# EAGLE schematic cos POC (EAGLE 9.4.0)
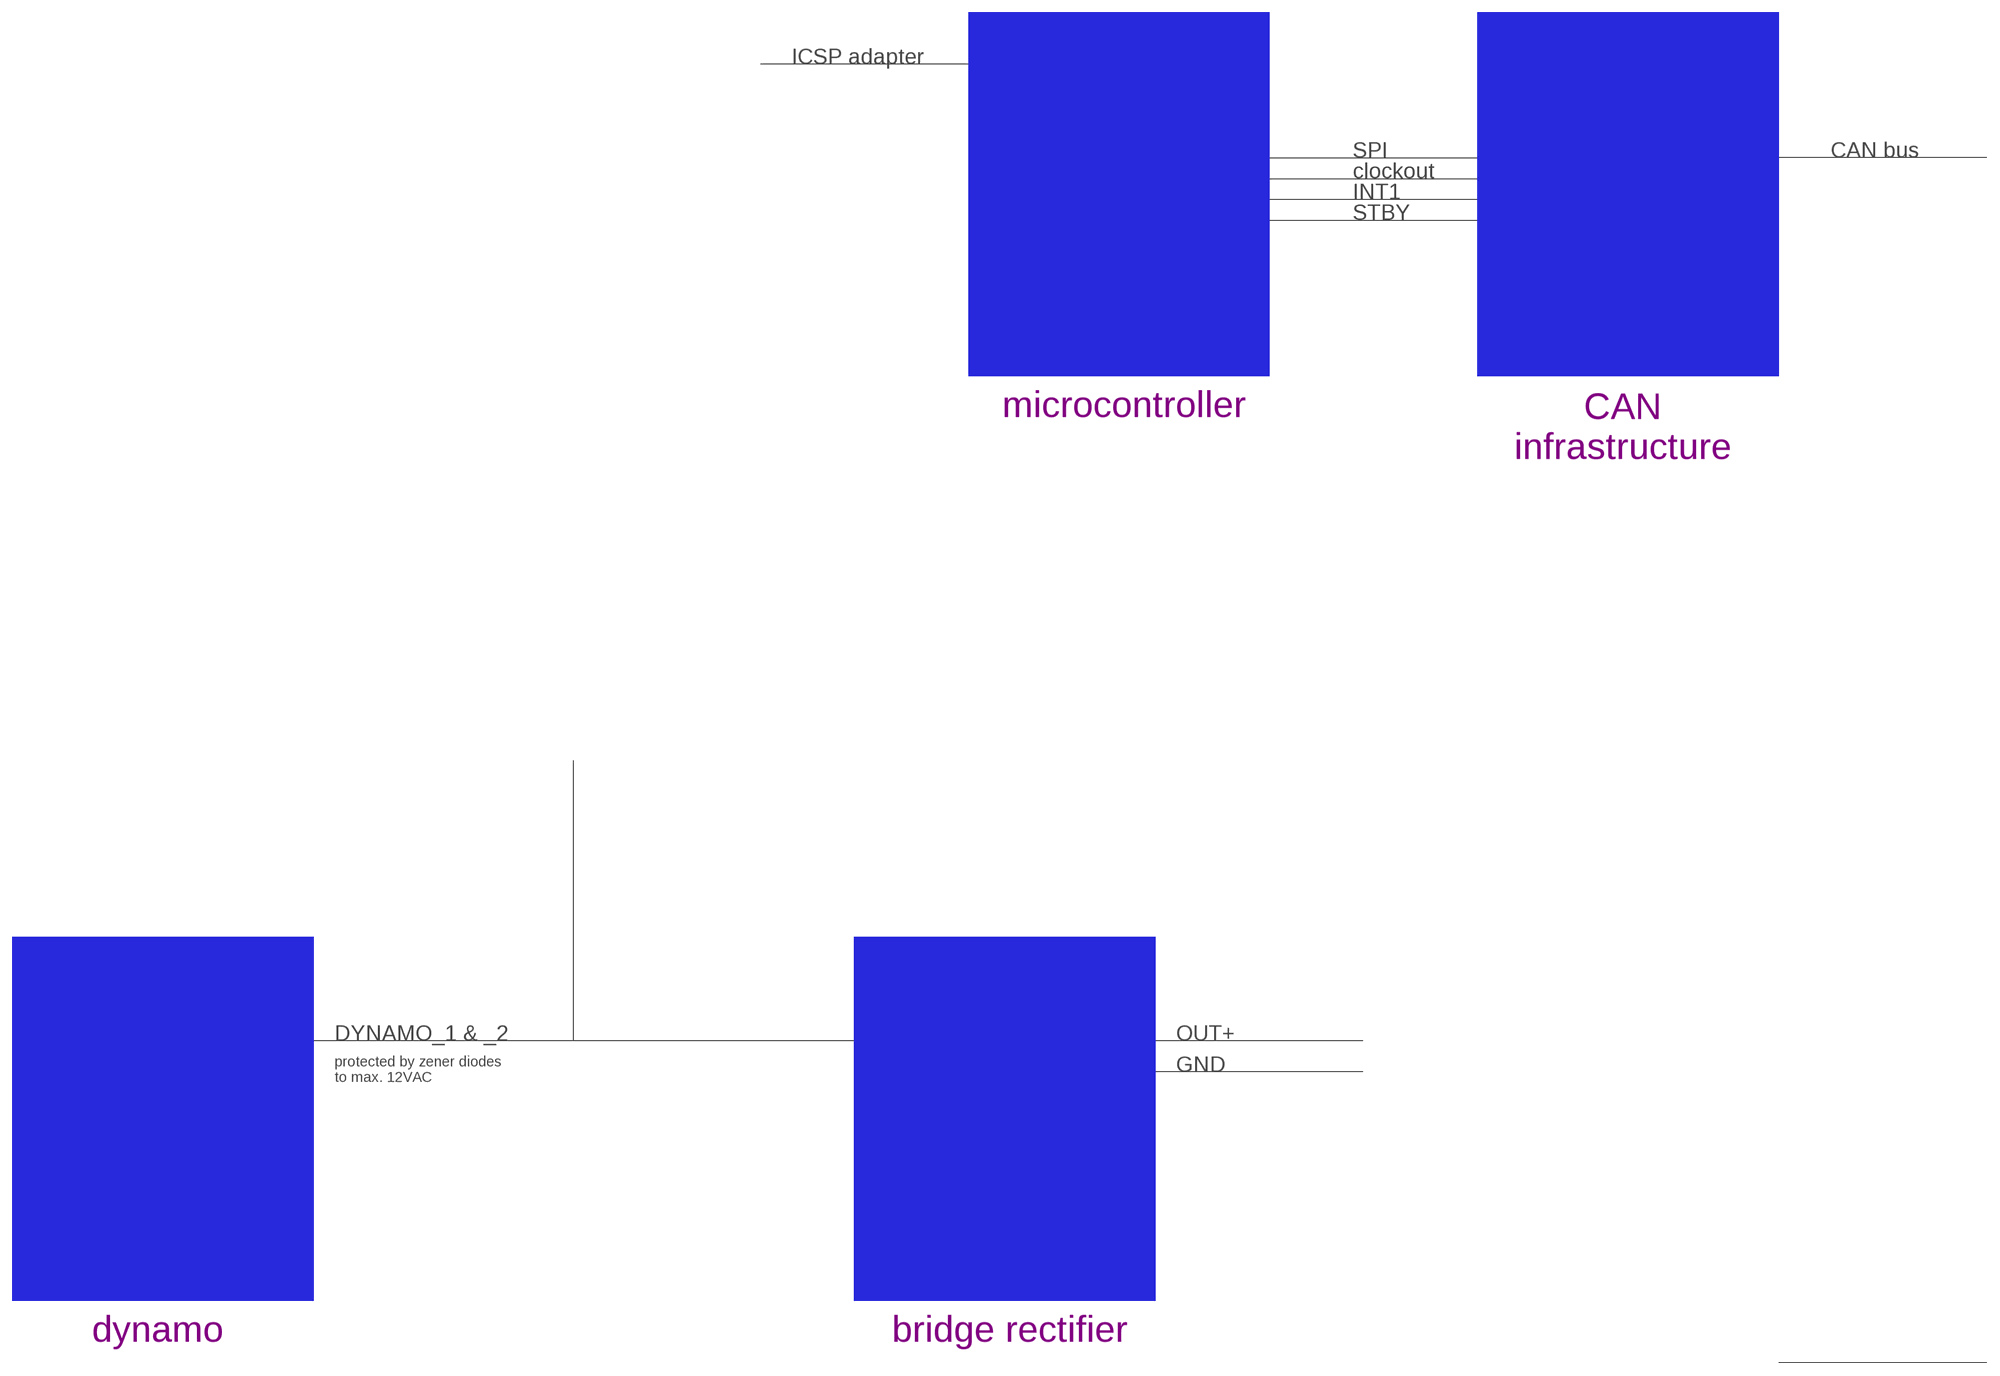
[diagram p0: schematic, sheet 1, part 1 of 3]
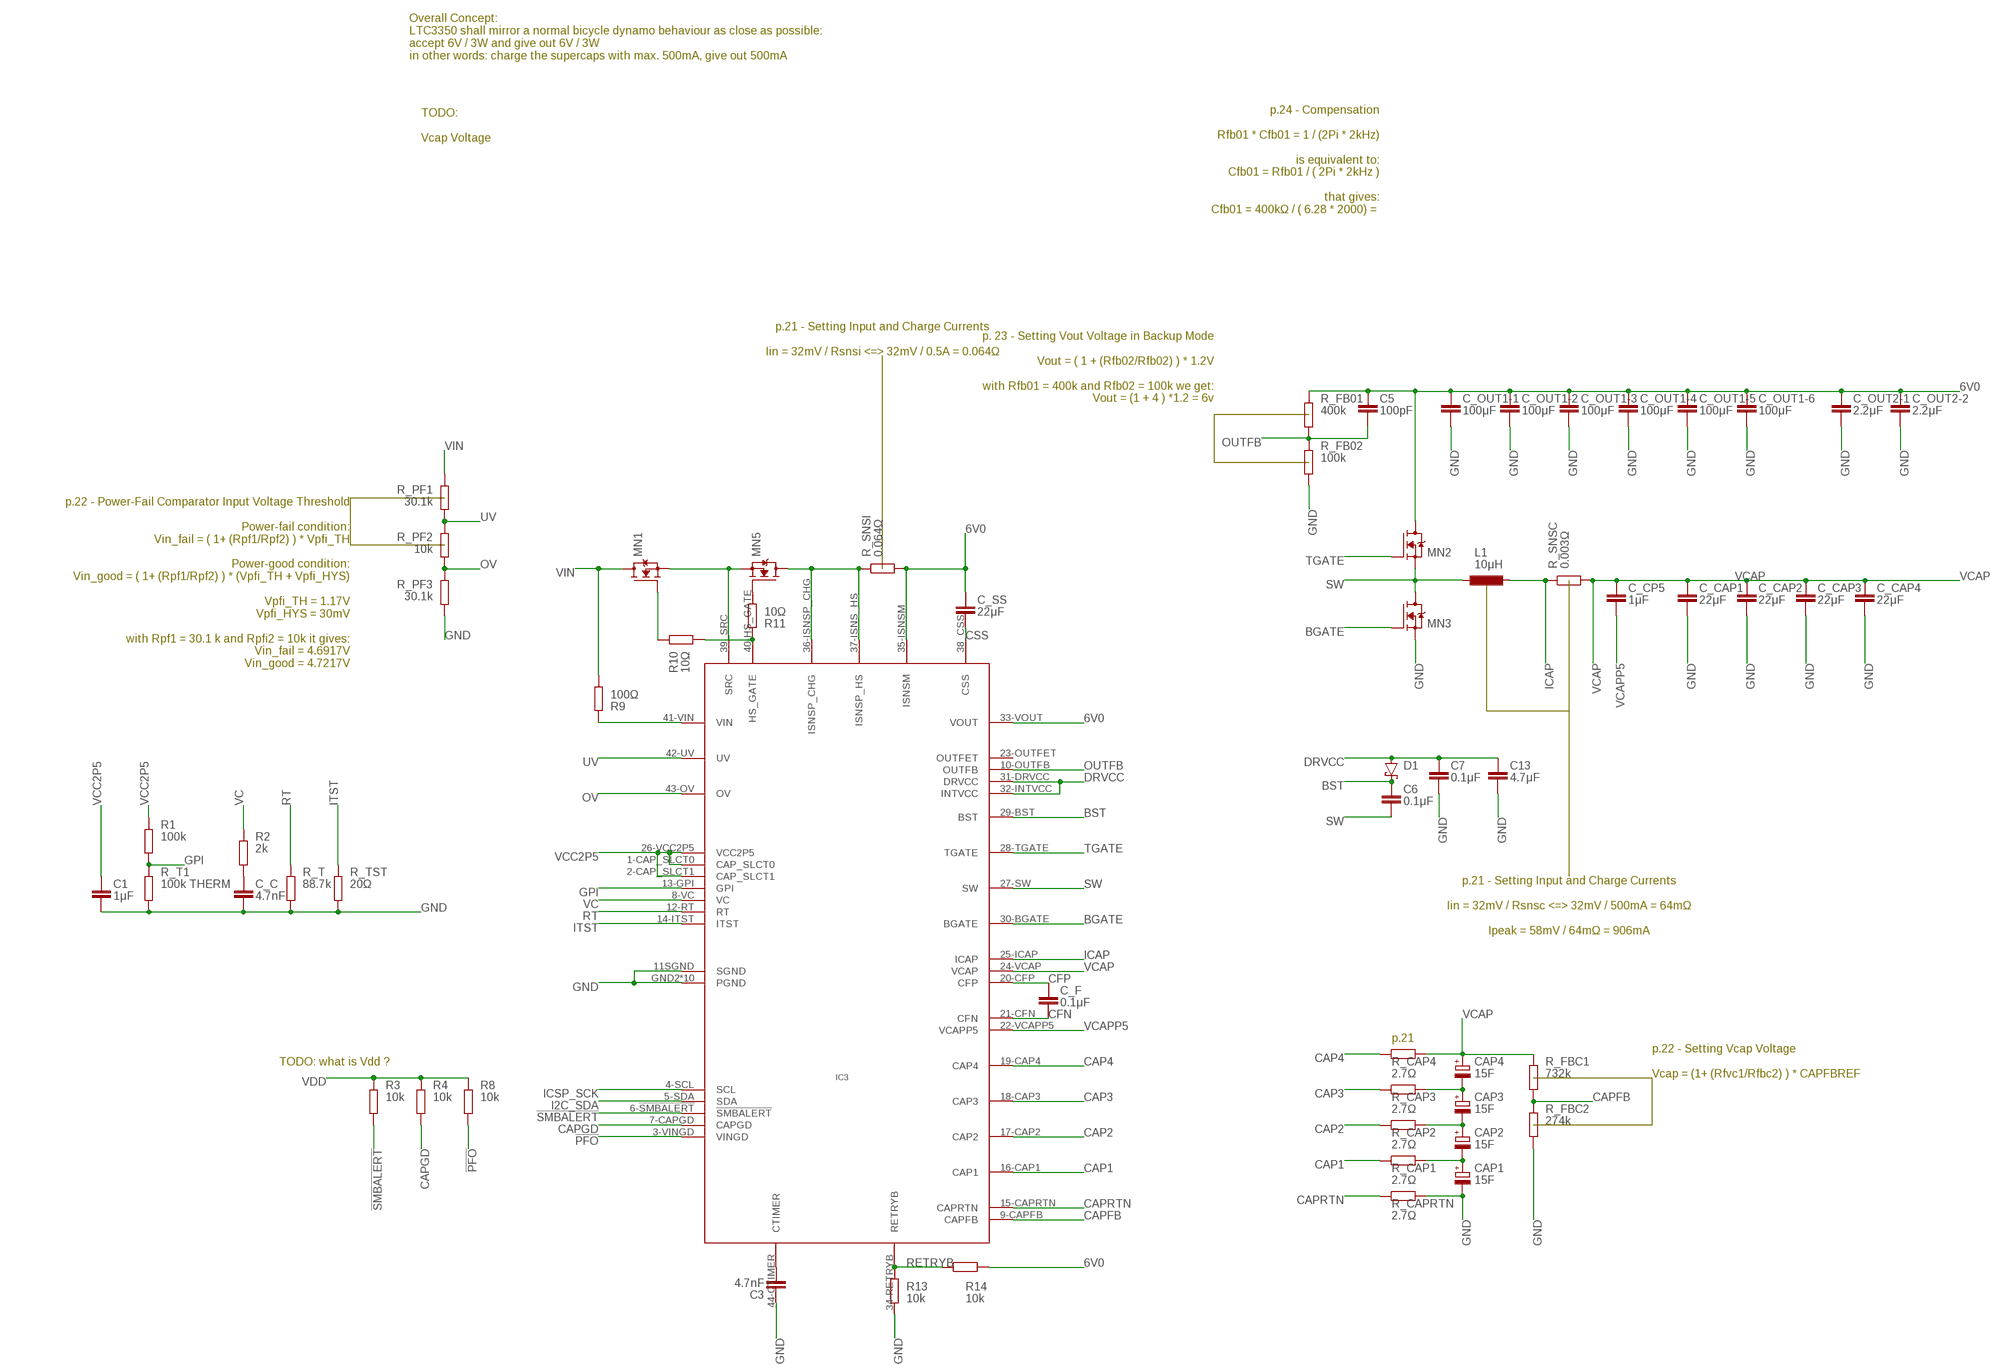
[diagram p1: schematic, sheet 1, part 2 of 3]
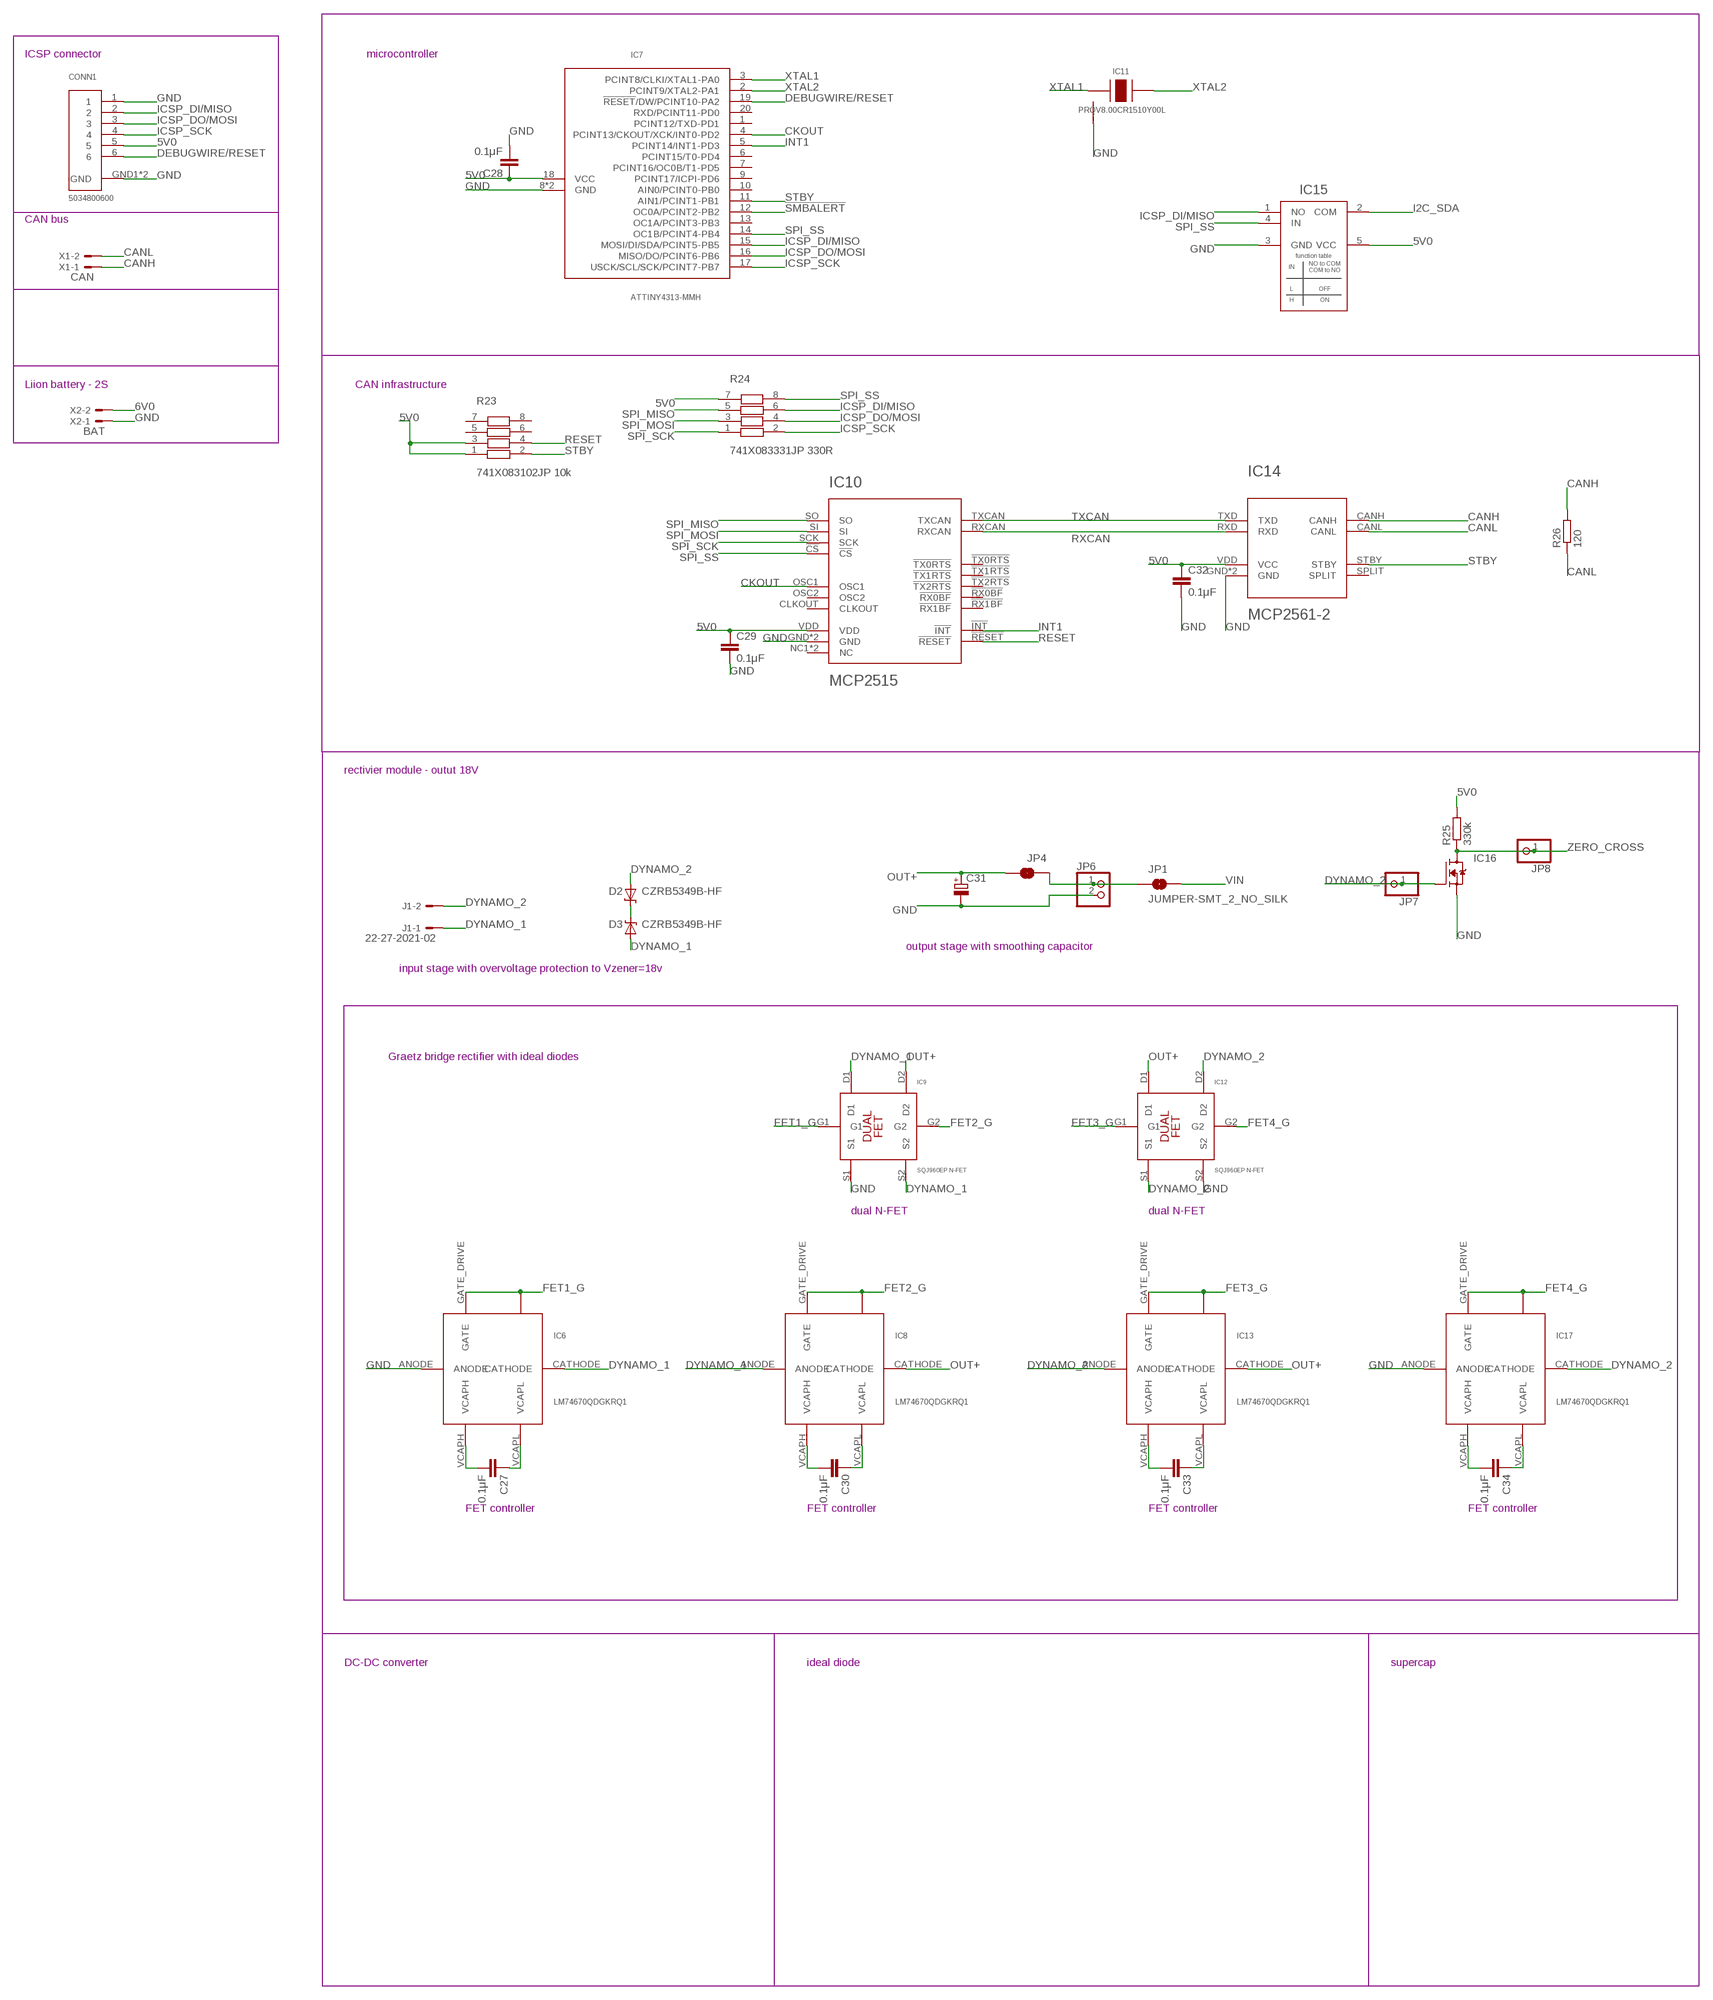
[diagram p2: schematic, sheet 1, part 3 of 3]

## Parts
C1  1μF  C-EUC0402  [C0402]
C3  4.7nF  C-EUC0402  [C0402]
C5  100pF  C-EUC0402  [C0402]
C6  0.1μF  C-EUC0402  [C0402]
C7  0.1μF  C-EUC0402  [C0402]
C13  4.7μF  C-EUC0402  [C0402]
C27  0.1μF  C-EUC0805  [C0805]
C28  0.1μF  C-EUC0402  [C0402]
C29  0.1μF  C-EUC0402  [C0402]
C30  0.1μF  C-EUC0805  [C0805]
C31  CPOL-EUB45181A  [B45181A]
C32  0.1μF  C-EUC0402  [C0402]
C33  0.1μF  C-EUC0805  [C0805]
C34  0.1μF  C-EUC0805  [C0805]
C_C  4.7nF  C-EUC0402  [C0402]
C_CAP1  22μF  C-EUC0402  [C0402]
C_CAP2  22μF  C-EUC0402  [C0402]
C_CAP3  22μF  C-EUC0402  [C0402]
C_CAP4  22μF  C-EUC0402  [C0402]
C_CP5  1μF  C-EUC0402  [C0402]
C_F  0.1μF  C-EUC0402  [C0402]
C_OUT1-1  100μF  C-EUC0402  [C0402]
C_OUT1-2  100μF  C-EUC0402  [C0402]
C_OUT1-3  100μF  C-EUC0402  [C0402]
C_OUT1-4  100μF  C-EUC0402  [C0402]
C_OUT1-5  100μF  C-EUC0402  [C0402]
C_OUT1-6  100μF  C-EUC0402  [C0402]
C_OUT2-1  2.2μF  C-EUC0402  [C0402]
C_OUT2-2  2.2μF  C-EUC0402  [C0402]
C_SS  22μF  C-EUC0402  [C0402]
CAP1  15F  CPOL-EUE5-8.5  [E5-8,5]
CAP2  15F  CPOL-EUE5-8.5  [E5-8,5]
CAP3  15F  CPOL-EUE5-8.5  [E5-8,5]
CAP4  15F  CPOL-EUE5-8.5  [E5-8,5]
CONN1  5034800600  [SMT]
D1  SCHOTTKY-DIODESMC  [SMC]
D2  CZRB5349B-HF  ZENER  [DO-214]
D3  CZRB5349B-HF  ZENER  [DO-214]
IC3  LTC3351  [QFN44]
IC6  LM74670QDGKRQ1  LM74670  [VSSOP-8]
IC7  ATTINY4313-MMH  ATTINY4313VQFN-20  [VQFN-20]
IC8  LM74670QDGKRQ1  LM74670  [VSSOP-8]
IC9  SQJ960EP N-FET  SQJ96XEP  [SO-8L]
IC10  MCP2515  MCP2515-I-ML  [QFN20]
IC11  PRQV8.00CR1510Y00L  PRQV  [SMT]
IC12  SQJ960EP N-FET  SQJ96XEP  [SO-8L]
IC13  LM74670QDGKRQ1  LM74670  [VSSOP-8]
IC14  MCP2561-2  [DFN10]
IC15  TS5A1066SOT-23  [SOT-23]
IC16  SIA456DJ  [SC-70-6]
IC17  LM74670QDGKRQ1  LM74670  [VSSOP-8]
J1  22-27-2021-02  [6410-02]
JP1  JUMPER-SMT_2_NO_SILK  [SMT-JUMPER_2_NO_SILK]
JP4  JUMPER-SMT_2_NO_SILK  [SMT-JUMPER_2_NO_SILK]
JP6  PINHD-1X2  [1X02]
JP7  PINHD-1X1  [1X01]
JP8  PINHD-1X1  [1X01]
L1  10μH  L-EUL1812  [L1812]
MN1  SIA456DJ  [SC-70-6]
MN2  SIA456DJ  [SC-70-6]
MN3  SIA456DJ  [SC-70-6]
MN5  SIA456DJ  [SC-70-6]
R1  100k  R-EU_R0402  [R0402]
R2  2k  R-EU_R0402  [R0402]
R3  10k  R-EU_R0402  [R0402]
R4  10k  R-EU_R0402  [R0402]
R8  10k  R-EU_R0402  [R0402]
R9  100Ω  R-EU_R0402  [R0402]
R10  10Ω  R-EU_R0402  [R0402]
R11  10Ω  R-EU_R0402  [R0402]
R13  10k  R-EU_R0402  [R0402]
R14  10k  R-EU_R0402  [R0402]
R23  741X083102JP 10k  741X083331JP  [0402-4R]
R24  741X083331JP 330R  741X083331JP  [0402-4R]
R25  330k  R-EU_R0805  [R0805]
R26  120  R-EU_R0805  [R0805]
R_CAP1  2.7Ω  R-EU_R0402  [R0402]
R_CAP2  2.7Ω  R-EU_R0402  [R0402]
R_CAP3  2.7Ω  R-EU_R0402  [R0402]
R_CAP4  2.7Ω  R-EU_R0402  [R0402]
R_CAPRTN  2.7Ω  R-EU_R0402  [R0402]
R_FB01  400k  R-EU_R0402  [R0402]
R_FB02  100k  R-EU_R0402  [R0402]
R_FBC1  732k  R-EU_R0402  [R0402]
R_FBC2  274k  R-EU_R0402  [R0402]
R_PF1  30.1k  R-EU_R0402  [R0402]
R_PF2  10k  R-EU_R0402  [R0402]
R_PF3  30.1k  R-EU_R0402  [R0402]
R_SNSC  0.003Ω  R-EU_R0402  [R0402]
R_SNSI  0.064Ω  R-EU_R0402  [R0402]
R_T  88.7k  R-EU_R0402  [R0402]
R_T1  100k THERM  R-EU_R0402  [R0402]
R_TST  20Ω  R-EU_R0402  [R0402]
X1  CAN  22-23-2021  [22-23-2021]
X2  BAT  22-23-2021  [22-23-2021]

## Nets
5V0: C28.1 C29.1 C32.1 CONN1.5 IC7.18(VCC) IC10.VDD IC14.VDD(VCC) IC15.5(VCC) R23.1 R23.3 R24.7 R25.2
6V0 [currett-0.45]: C5.1 C_OUT1-1.1 C_OUT1-2.1 C_OUT1-3.1 C_OUT1-4.1 C_OUT1-5.1 C_OUT1-6.1 C_OUT2-1.1 C_OUT2-2.1 C_SS.1 IC3.33-VOUT(VOUT) IC3.35-ISNSM(ISNSM) MN2.1D(D) MN2.2D(D) MN2.5D(D) MN2.6D(D) MN2.D R14.2 R_FB01.1 R_SNSI.2 X2.2
!PFO! [signal]: IC3.3-VINGD(VINGD) R8.2
!SMBALERT! [signal]: IC3.6-!SMBALERT!(!SMBALERT!) IC7.12(OC0A/PCINT2-PB2) R3.2
BGATE [signal]: IC3.30-BGATE(BGATE) MN3.3G(G)
BST [signal]: C6.1 D1.C IC3.29-BST(BST)
CANH: IC14.CANH R26.2 X1.1
CANL: IC14.CANL R26.1 X1.2
CAP1 [signal]: IC3.16-CAP1(CAP1) R_CAP1.1
CAP2 [signal]: IC3.17-CAP2(CAP2) R_CAP2.1
CAP3 [signal]: IC3.18-CAP3(CAP3) R_CAP3.1
CAP4 [signal]: IC3.19-CAP4(CAP4) R_CAP4.1
CAPFB: IC3.9-CAPFB(CAPFB) R_FBC1.1 R_FBC2.2
CAPGD [signal]: IC3.7-CAPGD(CAPGD) R4.2
CAPRTN [signal]: IC3.15-CAPRTN(CAPRTN) R_CAPRTN.1
CFN [signal]: C_F.2 IC3.21-CFN(CFN)
CFP [signal]: C_F.1 IC3.20-CFP(CFP)
CKOUT: IC7.4(PCINT13/CKOUT/XCK/INT0-PD2) IC10.OSC1
CSS [signal]: C_SS.2 IC3.38_CSS(CSS)
CTIMER [signal]: C3.2 IC3.44-CTIMER(CTIMER)
DEBUGWIRE/RESET [signal]: CONN1.6 IC7.19(!RESET!/DW/PCINT10-PA2)
DRVCC [signal]: C7.1 C13.1 D1.A IC3.31-DRVCC(DRVCC) IC3.32-INTVCC(INTVCC)
DYNAMO_1: D3.AN IC6.CATHODE IC8.ANODE IC9.D1 IC9.S2 J1.1
DYNAMO_2: D2.AN IC12.D2 IC12.S1 IC13.ANODE IC16.3G(G) IC17.CATHODE J1.2 JP7.1
FET1_G: IC6.GATE_DRIVE(GATE) IC6.GATE_PULLD IC9.G1
FET2_G: IC8.GATE_DRIVE(GATE) IC8.GATE_PULLD IC9.G2
FET3_G: IC12.G1 IC13.GATE_DRIVE(GATE) IC13.GATE_PULLD
FET4_G: IC12.G2 IC17.GATE_DRIVE(GATE) IC17.GATE_PULLD
GND: C1.2 C3.1 C7.2 C13.2 C28.2 C29.2 C31.- C32.2 C_C.2 C_CAP1.2 C_CAP2.2 C_CAP3.2 C_CAP4.2 C_OUT1-1.2 C_OUT1-2.2 C_OUT1-3.2 C_OUT1-4.2 C_OUT1-5.2 C_OUT1-6.2 C_OUT2-1.2 C_OUT2-2.2 CAP1.- CONN1.1 CONN1.GND1(GND) CONN1.GND2(GND) IC3.11SGND(SGND) IC3.GND2(PGND) IC3.GND3(PGND) IC3.GND4(PGND) IC3.GND5(PGND) IC3.GND6(PGND) IC3.GND7(PGND) IC3.GND8(PGND) IC3.GND9(PGND) IC3.GND10(PGND) IC3.PGND IC6.ANODE IC7.8(GND) IC7.GND IC9.S1 IC10.GND IC10.GND6(GND) IC11.GND IC12.S2 IC14.GND IC14.VSS(GND) IC15.3(GND) IC16.4S(S) IC16.S IC17.ANODE JP6.2 MN3.4S(S) MN3.S R13.2 R_CAPRTN.2 R_FB02.2 R_FBC2.1 R_PF3.2 R_T1.2 R_T.2 R_TST.2 X2.1
GPI [signal]: IC3.13-GPI(GPI) R1.2 R_T1.1
I2C_SDA [signal]: IC3.5-SDA(SDA) IC15.2(COM)
ICAP [signal]: IC3.25-ICAP(ICAP) L1.2 R_SNSC.1
ICSP_DI/MISO [signal]: CONN1.2 IC7.15(MOSI/DI/SDA/PCINT5-PB5) IC15.1(NO) R24.6
ICSP_DO/MOSI [signal]: CONN1.3 IC7.16(MISO/DO/PCINT6-PB6) R24.4
ICSP_SCK [signal]: CONN1.4 IC3.4-SCL(SCL) IC7.17(USCK/SCL/SCK/PCINT7-PB7) R24.2
INT1: IC7.5(PCINT14/INT1-PD3) IC10.!INT!
ITST [signal]: IC3.14-ITST(ITST) R_TST.1
N$1 [VCC]: IC3.39_SRC(SRC) MN1.4S(S) MN1.S MN5.4S(S) MN5.S
N$2: MN1.3G(G) R10.1
N$3: C27.2 IC6.VCAPH
N$4: JP1.1 JP4.2 JP6.1
N$6 [VCC]: IC3.36-ISNSP_CHG(ISNSP_CHG) IC3.37-ISNS_HS(ISNSP_HS) MN5.1D(D) MN5.2D(D) MN5.5D(D) MN5.6D(D) MN5.D R_SNSI.1
N$7 [signal]: CAP3.+ CAP4.- R_CAP3.2
N$8 [signal]: CAP2.+ CAP3.- R_CAP2.2
N$9: C27.1 IC6.VCAPL
N$10: C34.2 IC17.VCAPH
N$11: C34.1 IC17.VCAPL
N$12: C33.1 IC13.VCAPL
N$13: C33.2 IC13.VCAPH
N$14: C30.1 IC8.VCAPL
N$15: C30.2 IC8.VCAPH
N$16 [signal]: CAP1.+ CAP2.- R_CAP1.2
N$18: MN5.3G(G) R11.2
N$19: C_C.1 R2.2
N$20 [signal]: IC3.40-HS_GATE(HS_GATE) R10.2 R11.1
N$27 [signal]: IC3.41-VIN(VIN) R9.1
OUT+: C31.+ IC8.CATHODE IC9.D2 IC12.D1 IC13.CATHODE JP4.1
OUTFB [signal]: C5.2 IC3.10-OUTFB(OUTFB) R_FB01.2 R_FB02.1
OV [signal]: IC3.43-OV(OV) R_PF2.2 R_PF3.1
RESET [signal]: IC10.!RESET! R23.4
RETRYB [signal]: IC3.34-RETRYB(RETRYB) R13.1 R14.1
RT [signal]: IC3.12-RT(RT) R_T.1
RXCAN: IC10.RXCAN IC14.RXD
SPI_MISO: IC10.SO R24.5
SPI_MOSI: IC10.SI R24.3
SPI_SCK: IC10.SCK R24.1
SPI_SS: IC7.14(OC1B/PCINT4-PB4) IC10.!CS! IC15.4(IN) R24.8
STBY: IC7.11(AIN1/PCINT1-PB1) IC14.STBY R23.2
SW [signal]: C6.2 IC3.27-SW(SW) L1.1 MN2.4S(S) MN2.S MN3.1D(D) MN3.2D(D) MN3.5D(D) MN3.6D(D) MN3.D
TGATE [signal]: IC3.28-TGATE(TGATE) MN2.3G(G)
TXCAN: IC10.TXCAN IC14.TXD
UV [signal]: IC3.42-UV(UV) R_PF1.2 R_PF2.1
VC [signal]: IC3.8-VC(VC) R2.1
VCAP [VCC]: C_CAP1.1 C_CAP2.1 C_CAP3.1 C_CAP4.1 C_CP5.1 CAP4.+ IC3.24-VCAP(VCAP) R_CAP4.2 R_FBC1.2 R_SNSC.2
VCAPP5 [signal]: C_CP5.2 IC3.22-VCAPP5(VCAPP5)
VCC2P5 [signal]: C1.1 IC3.1-CAP_SLCT0(CAP_SLCT0) IC3.2-CAP_SLCT1(CAP_SLCT1) IC3.26-VCC2P5(VCC2P5) R1.1
VDD: R3.1 R4.1 R8.1
VIN [VCC]: JP1.2 MN1.1D(D) MN1.2D(D) MN1.5D(D) MN1.6D(D) MN1.D R9.2 R_PF1.1
XTAL1: IC7.3(PCINT8/CLKI/XTAL1-PA0) IC11.XTAL1
XTAL2: IC7.2(PCINT9/XTAL2-PA1) IC11.XTAL2
ZENER_COMMON: D2.CAT D3.CAT
ZERO_CROSS: IC16.1D(D) IC16.2D(D) IC16.5D(D) IC16.6D(D) IC16.D JP8.1 R25.1
Unconnected: IC3.23-OUTFET(OUTFET) IC7.1(PCINT12/TXD-PD1) IC7.6(PCINT15/T0-PD4) IC7.7(PCINT16/OC0B/T1-PD5) IC7.9(PCINT17/ICPI-PD6) IC7.10(AIN0/PCINT0-PB0) IC7.13(OC1A/PCINT3-PB3) IC7.20(RXD/PCINT11-PD0) IC10.!RX0BF! IC10.!RX1BF! IC10.!TX0RTS! IC10.!TX1RTS! IC10.!TX2RTS! IC10.CLKOUT IC10.NC1(NC) IC10.NC2(NC) IC10.OSC2 IC14.SPLIT R23.5 R23.6 R23.7 R23.8

## Notes on the sheet
- Overall Concept:
  LTC3350 shall mirror a normal bicycle dynamo behaviour as close as possible:
  accept 6V / 3W and give out 6V / 3W
  in other words: charge the supercaps with max. 500mA, give out 500mA
- TODO:
  
  Vcap Voltage
- p.24 - Compensation
  
  Rfb01 * Cfb01 = 1 / (2Pi * 2kHz)
  
  is equivalent to:
  Cfb01 = Rfb01 / ( 2Pi * 2kHz )
  
  that gives:
  Cfb01 = 400kΩ / ( 6.28 * 2000) =
- ICSP connector | microcontroller
- p.21 - Setting Input and Charge Currents
  
  Iin = 32mV / Rsnsi <=> 32mV / 0.5A = 0.064Ω
- p. 23 - Setting Vout Voltage in Backup Mode
  
  Vout = ( 1 + (Rfb02/Rfb02) ) * 1.2V
  
  with Rfb01 = 400k and Rfb02 = 100k we get:
  Vout = (1 + 4 ) *1.2 = 6v
- CAN bus
- p.22 - Power-Fail Comparator Input Voltage Threshold
  
  Power-fail condition:
  Vin_fail = ( 1+ (Rpf1/Rpf2) ) * Vpfi_TH
  
  Power-good condition:
  Vin_good = ( 1+ (Rpf1/Rpf2) ) * (Vpfi_TH + Vpfi_HYS)
  
  Vpfi_TH = 1.17V
  Vpfi_HYS = 30mV
  
  with Rpf1 = 30.1 k and Rpfi2 = 10k it gives:
  Vin_fail = 4.6917V
  Vin_good = 4.7217V
- ICSP adapter
- SPI | CAN bus | Liion battery - 2S | CAN infrastructure
- clockout
- INT1
- STBY
- p.21 - Setting Input and Charge Currents
  
  Iin = 32mV / Rsnsc <=> 32mV / 500mA = 64mΩ
  
  Ipeak = 58mV / 64mΩ = 906mA
- microcontroller
- CAN
  infrastructure
- rectivier module - outut 18V
- p.21
- TODO: what is Vdd ?
- p.22 - Setting Vcap Voltage
  
  Vcap = (1+ (Rfvc1/Rfbc2) ) * CAPFBREF
- output stage with smoothing capacitor
- input stage with overvoltage protection to Vzener=18v
- Graetz bridge rectifier with ideal diodes
- dual N-FET | dual N-FET
- DYNAMO_1 & _2 | OUT+
- GND
- protected by zener diodes 
  to max. 12VAC
- FET controller | FET controller | FET controller | FET controller
- dynamo | bridge rectifier
- DC-DC converter | ideal diode | supercap

## Library data of the parts
C1 C3 C5-C7 C13 C27-C30 C32-C34 C_C C_CAP1-C_CAP4 C_CP5 C_F C_OUT1-1-C_OUT1-6 C_OUT2-1 C_OUT2-2 C_SS = rcl:C-EU: CAPACITOR, European symbol; SPICEPREFIX: C
C31 CAP1-CAP4 = rcl:CPOL-EU: POLARIZED CAPACITOR, European symbol; SPICEPREFIX: C
CONN1 = 5034800600 FPC Connector:5034800600
D1 = diode:SCHOTTKY-DIODE: Schottky Diode
D2 D3 = zener:ZENER: Zener diode
IC3 = LTC3351f - Hot Swappable Supercapacitor Charger, Backup Controller and  System Monitor:LTC3351
IC6 IC8 IC13 IC17 = LM74670 - Smart Diode Rectifier Controller:LM74670
IC7 = ATtiny4313 microcontroller:ATTINY4313
IC9 IC12 = SQJ96XEP - MosFET:SQJ96XEP
IC10 = MCP2515-I-ML - Standalonce CAN Controller with SPI Interface:MCP2515-I-ML
IC11 = PRQV8.00CR1510Y00L - 8MHz resonator:PRQV
IC14 = MCP2561-2 - High-Speed CAN Transceiver:MCP2561-2
IC15 = TS5A1066 Analogue Switch IC:TS5A1066
IC16 MN1-MN3 MN5 = SIA456DJ-T1-GE3  N-Fet:SIA456DJ
J1 = con-molex:22-?-02: CONNECTOR wire to board 2.54 mm (.1 inch) pitch header; MF: MOLEX; OC_FARNELL: unknown; OC_NEWARK: unknown
JP1 JP4 = SparkFun-Jumpers:JUMPER-SMT_2_NO: Normally open jumper This jumper has two pads in close proximity to each other. Apply solder to close the connection. Round pads are easier to solder for beginners, but are a lot larger. SparkFun Product that uses the round pads: SparkFun EL Sequencer <https://www.sparkfun.com/products/12781>
JP6 = pinhead:PINHD-1X2: PIN HEADER
JP7 JP8 = pinhead:PINHD-1X1: PIN HEADER
L1 = rcl:L-EU: INDUCTOR, European symbol; SPICEPREFIX: L
R1-R4 R8-R11 R13 R14 R25 R26 R_CAP1-R_CAP4 R_CAPRTN R_FB01 R_FB02 R_FBC1 R_FBC2 R_PF1-R_PF3 R_SNSC R_SNSI R_T R_T1 R_TST = rcl:R-EU_: RESISTOR, European symbol; SPICEPREFIX: R
R23 R24 = 74x-1133528 Resistor Array:741X083331JP
X1 X2 = con-molex:22-23-2021: .100" (2.54mm) Center Header - 2 Pin; MF: MOLEX; MPN: 22-23-2021; OC_FARNELL: 1462926; OC_NEWARK: 25C3832

## Net classes
0 GND: width 0.3 mm, drill 0.35 mm, clearance 0.2 mm
1 VCC: width 0.3 mm, drill 0.35 mm, clearance 0.2 mm
2 signal: width 0.2 mm, drill 0.35 mm, clearance 0.2 mm
5 currett-0.45: width 0.45 mm, drill 0.35 mm, clearance 0.2 mm